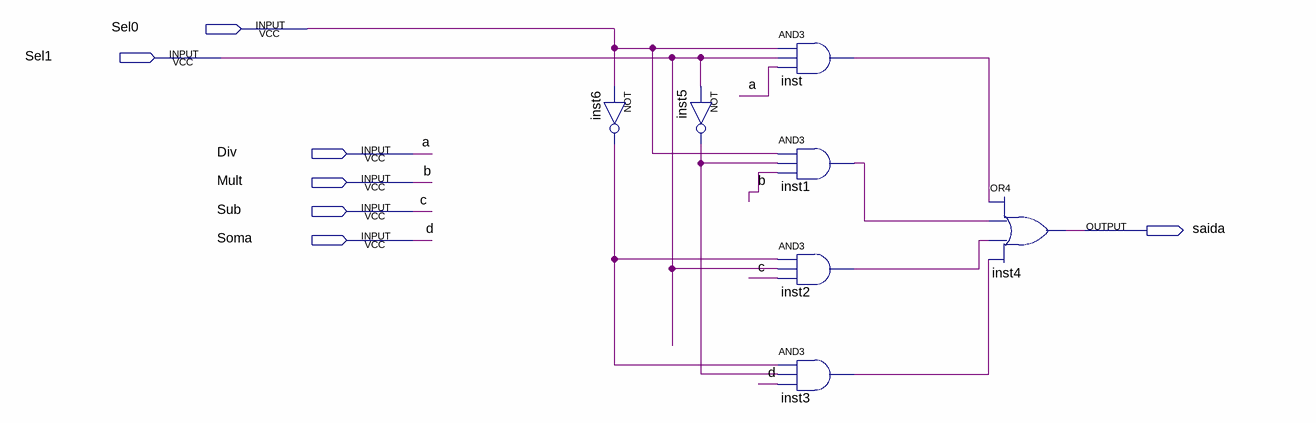
[diagram p0: schematic sheet]
// Quartus schematic multiplex.bdf as structural Verilog: 7 symbols, 7 pins
module multiplex (
  input  Sel0,
  input  Sel1,
  input  Div,
  input  Mult,
  input  Sub,
  input  Soma,
  output saida
);

  wire inst1_out, inst2_out, inst3_out, inst5_out, inst6_out, inst_out;

  not inst6 (inst6_out, Sel0);
  not inst5 (inst5_out, Sel1);
  and inst (inst_out, Sel0, Sel1, Div);
  and inst1 (inst1_out, Sel0, inst5_out, Mult);
  and inst2 (inst2_out, inst6_out, Sel1, Sub);
  and inst3 (inst3_out, inst6_out, inst5_out, Soma);
  or inst4 (saida, inst_out, inst1_out, inst2_out, inst3_out);

  // Other names for the same wires on the sheet: a = Div; b = Mult; c = Sub; d = Soma
endmodule
